# Altium schematic sheet Display.SchDoc
size A4; SheetNumber: 5; SheetTotal: 5; SPICEModelCacheCQHMTQAC: <root> / <DocumentId>CQHMTQAC</DocumentId> / </root>
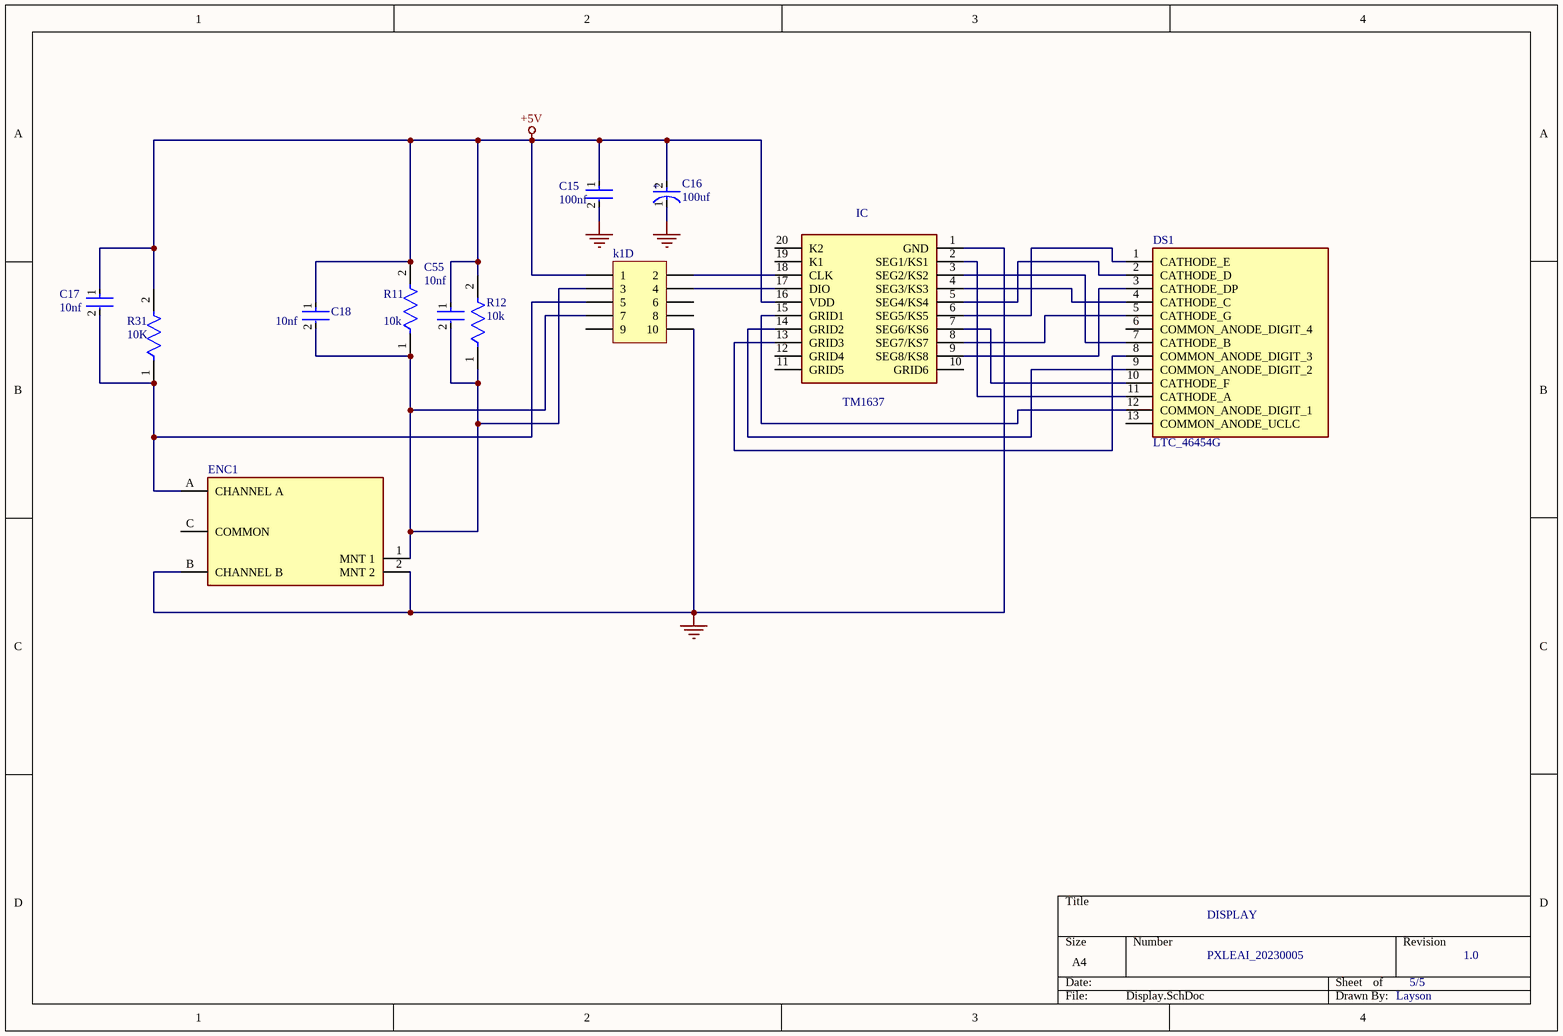
[diagram p0: Display.SchDoc]

## Parts
C15  100nf  [FP-C320C-MFG]
C16  100uf  [FP-RAD-TH-D_8_0_5-L_11_5-MFG]
C17  10nf  [FP-RDE0M1-MFG]
C18  10nf  [FP-RDE0M1-MFG]
C55  10nf  [FP-RDE0M1-MFG]
DS1  LTC_46454G  [LTC46454G]
ENC1  PEC11R-4015F-N0024  [FP-PEC11R-4015F-N0024-MFG]  (value not drawn)
IC  TM1637  [SOIC127P1045X280-20N]
k1D  Header 5X2  [HDR2X5]  (value not drawn)
R11  10k  [FP-CF18-MFG]
R12  10k  [FP-CF18-MFG]
R31  10K  [FP-CF18-MFG]

## Nets
+5V: C15.1 C16.2(A) C17.1 C18.1 C55.1 IC.16(VDD) k1D.1 R11.2 R12.2 R31.2
GND: C15.2 C16.1(C) ENC1.2(MNT_2) ENC1.B(CHANNEL_B) IC.1(GND) k1D.10
NetC17_2: C17.2 ENC1.A(CHANNEL_A) k1D.5 R31.1
NetC18_2: C18.2 C55.2 ENC1.1(MNT_1) k1D.3 k1D.7 R11.1 R12.1
NetDS1_1: DS1.1(CATHODE_E) IC.6(SEG5/KS5)
NetDS1_2: DS1.2(CATHODE_D) IC.5(SEG4/KS4)
NetDS1_3: DS1.3(CATHODE_DP) IC.9(SEG8/KS8)
NetDS1_4: DS1.4(CATHODE_C) IC.4(SEG3/KS3)
NetDS1_5: DS1.5(CATHODE_G) IC.8(SEG7/KS7)
NetDS1_7: DS1.7(CATHODE_B) IC.3(SEG2/KS2)
NetDS1_8: DS1.8(COMMON_ANODE_DIGIT_3) IC.13(GRID3)
NetDS1_9: DS1.9(COMMON_ANODE_DIGIT_2) IC.14(GRID2)
NetDS1_10: DS1.10(CATHODE_F) IC.7(SEG6/KS6)
NetDS1_11: DS1.11(CATHODE_A) IC.2(SEG1/KS1)
NetDS1_12: DS1.12(COMMON_ANODE_DIGIT_1) IC.15(GRID1)
NetIC_17: IC.17(DIO) k1D.4
NetIC_18: IC.18(CLK) k1D.2

Not connected (* = marked no-connect by the designer): DS1 6(COMMON_ANODE_DIGIT_4) 13(COMMON_ANODE_UCLC); ENC1 C(COMMON); IC 10(GRID6) 11(GRID5) 12(GRID4) 19(K1) 20(K2); k1D 6 8 9

## Notes on the sheet
- DISPLAY
- PXLEAI_20230005
- 5/5
- 1.0
- Layson
- (in symbol CMP-05427-002079-1) +

## Library data of the parts
C15 = CMP-03020-013948-1: CAP CER 0.1UF 50V X7R RADIAL; Manufacturer Part Number: C320C104J5R5TA7301; Manufacturer: KEMET; Tolerance: 5%; Material: Ceramic; Temperature Coefficient: 15%; Temperature Range High: +125°C; Temperature: -55°C to +125°C; Capacitance: 0.1uF; Temperature Characteristic: X7R; Height: 7.36mm; Automotive: No; Device Class L2: Capacitors; Package: C320C; Device Class L3: Ceramic Capacitors; Value: 0.1uF; Voltage Rating: 50V; Digikey Description: CAP CER 0.1UF 50V X7R RADIAL; Lead Free: Yes; Device Class L1: Passive Components; Octopart: https://octopart.com/c320c104j5r5ta7301-kemet-20072933; Temperature Range Low: -55°C; Mouser Description: Multilayer Ceramic Capacitors MLCC - Leaded 50volts 0.1uF 5% X7R; ComponentLink2Description: Datasheet; Category: Cap; ComponentLink2URL: https://content.kemet.com/datasheets/KEM_C1050_GOLDMAX_X7R.pdf; RoHS: TRUE
C16 = CMP-05427-002079-1: Aluminum Electrolytic Capacitors (Radial Lead Type) 100uF ±20% 50V; ESR (Equivalent Series Resistance): 61mR; Lead Diameter: 0.6mm; Ripple Current (AC): 870mA; Life (Hours): 6000Hour; Lead/Base Style: Straight; Height - Seated (Max): 0.512inch; Height: 11.5mm; REACH SVHC: No SVHC; Contact Plating: Tin; Impedance: 61mR; Capacitance: 100uF; Voltage: 50V; Termination: Radial; Series: FR; Voltage Rating: 50V; Lead Pitch: 3.5mm; Diameter: 8mm; Number of Pins: 2; Min Operating Temperature: -40°C; Mount: Through Hole; Ripple Current: 870mA; Radiation Hardening: No; Length: 11.5mm; Max Operating Temperature: 105°C; Construction: RADIAL; Packaging: Bulk; Package Quantity: 200; Case/Package: Radial; RoHS Compliant: Yes; Voltage Rating (DC): 50V; Tolerance: 20%
C17 C18 C55 = CMP-06035-022384-1: Ceramic Capacitor 10nF ±10% 50V X7R Radial; Lead Diameter: 0.5mm; Lead/Base Style: Kinked; Packaging: Tape and Reel; Min Operating Temperature: -55°C; Height: 3.5mm; Package Quantity: 2000; Capacitance: 10nF; Termination: Radial; Resistor Type: Ceramic; Max Operating Temperature: 125°C; Height - Seated (Max): 0.236inch; Mount: Through Hole; Length: 0.157inch; Case/Package: Radial; Voltage Rating (DC): 50V; Tolerance: 10%; Width: 3.5mm; Dielectric: X7R; Lead Free: Lead Free; Voltage Rating: 50V; Lead Pitch: 0.197inch
DS1 = LTC_46454G: Display; Manufacturer_Name: Lite-On; Manufacturer_Part_Number: LTC 46454G; Datasheet Link: https://optoelectronics.liteon.com/upload/download/DS-30-98-067/C46454G.pdf; Height: 16.25mm
ENC1 = CMP-07421-000003-1: ROTARY ENCODER MECHANICAL 24PPR; Manufacturer: Bourns; Current Rating: 10mA; Number Of Circuits: 1; Conn Orientation: Vertical; Encoder Type: Incremental; Detent: No; Pulses Per Rev: 24; Voltage Rating Dc: 5V; Manufacturer Part Number: PEC11R-4015F-N0024; Height: 22.3mm; ComponentLink2URL: https://www.bourns.com/docs/product-datasheets/pec11r.pdf?sfvrsn=bb617cbf_7; Mouser Description: Encoders 15mm SHAFT NO SWITCH; Package: 0; RoHS: TRUE; Temperature Range High: +70°C; Device Class L1: Electromechanical; Device Class L3: Encoders; Temperature Range Low: -30°C; Device Class L2: Switches; Temperature: -30°C to +70°C; Category: Enc; ComponentLink2Description: Datasheet; Lead Free: Yes; Automotive: No; Octopart: https://octopart.com/pec11r-4015f-n0024-bourns-26648251; Digikey Description: ROTARY ENCODER MECHANICAL 24PPR
IC = TM1637__SOP_: LED Drive Control Special Circuit; Manufacturer_Name: TITAN MICRO ELECTRONICS; Manufacturer_Part_Number: TM1637 (SOP); Geometry.Height: 2.8mm; Mouser Part Number: *; Mouser Price/Stock: *; Arrow Part Number: *; Arrow Price/Stock: *; Datasheet Link: https://www.mcielectronics.cl/website_MCI/static/documents/Datasheet_TM1637.pdf
k1D = Header 5X2: Header, 5-Pin, Dual row; LatestRevisionDate: 17-Jul-2002; LatestRevisionNote: Re-released for DXP Platform.; Publisher: Altium Limited
R11 R12 R31 = CMP-26528-000002-1: RES 10K OHM 1/8W 5% CF AXIAL; Manufacturer Part Number: CF18JT10K0; Manufacturer: Stackpole Electronics; Power Rating: 0.125W; Temperature Coefficient: 0-500ppm/°C; Resistance: 10kΩ; Voltage Rating: 250V; Value: 10kΩ; Temperature: -55°C to +155°C; Height: 2mm; Lead Free: Yes; Automotive: No; Device Class L2: Resistors; Package: CF18; Series: CF; ComponentLink2Description: Datasheet; Ipc Land Pattern Name: RESAD656W65L360D200; Temperature Range High: +155°C; RoHS: TRUE; Device Class L3: Through-Hole Resistors; Temperature Range Low: -55°C; Device Class L1: Passive Components; Category: Res; Octopart: https://octopart.com/cf18jt10k0-stackpole+electronics-19205642; Composition: Carbon Film; Digikey Description: RES 10K OHM 1/8W 5% CF AXIAL; ComponentLink2URL: http://www.seielect.com/Catalog/SEI-CF_CFM.pdf; Tolerance: 5%